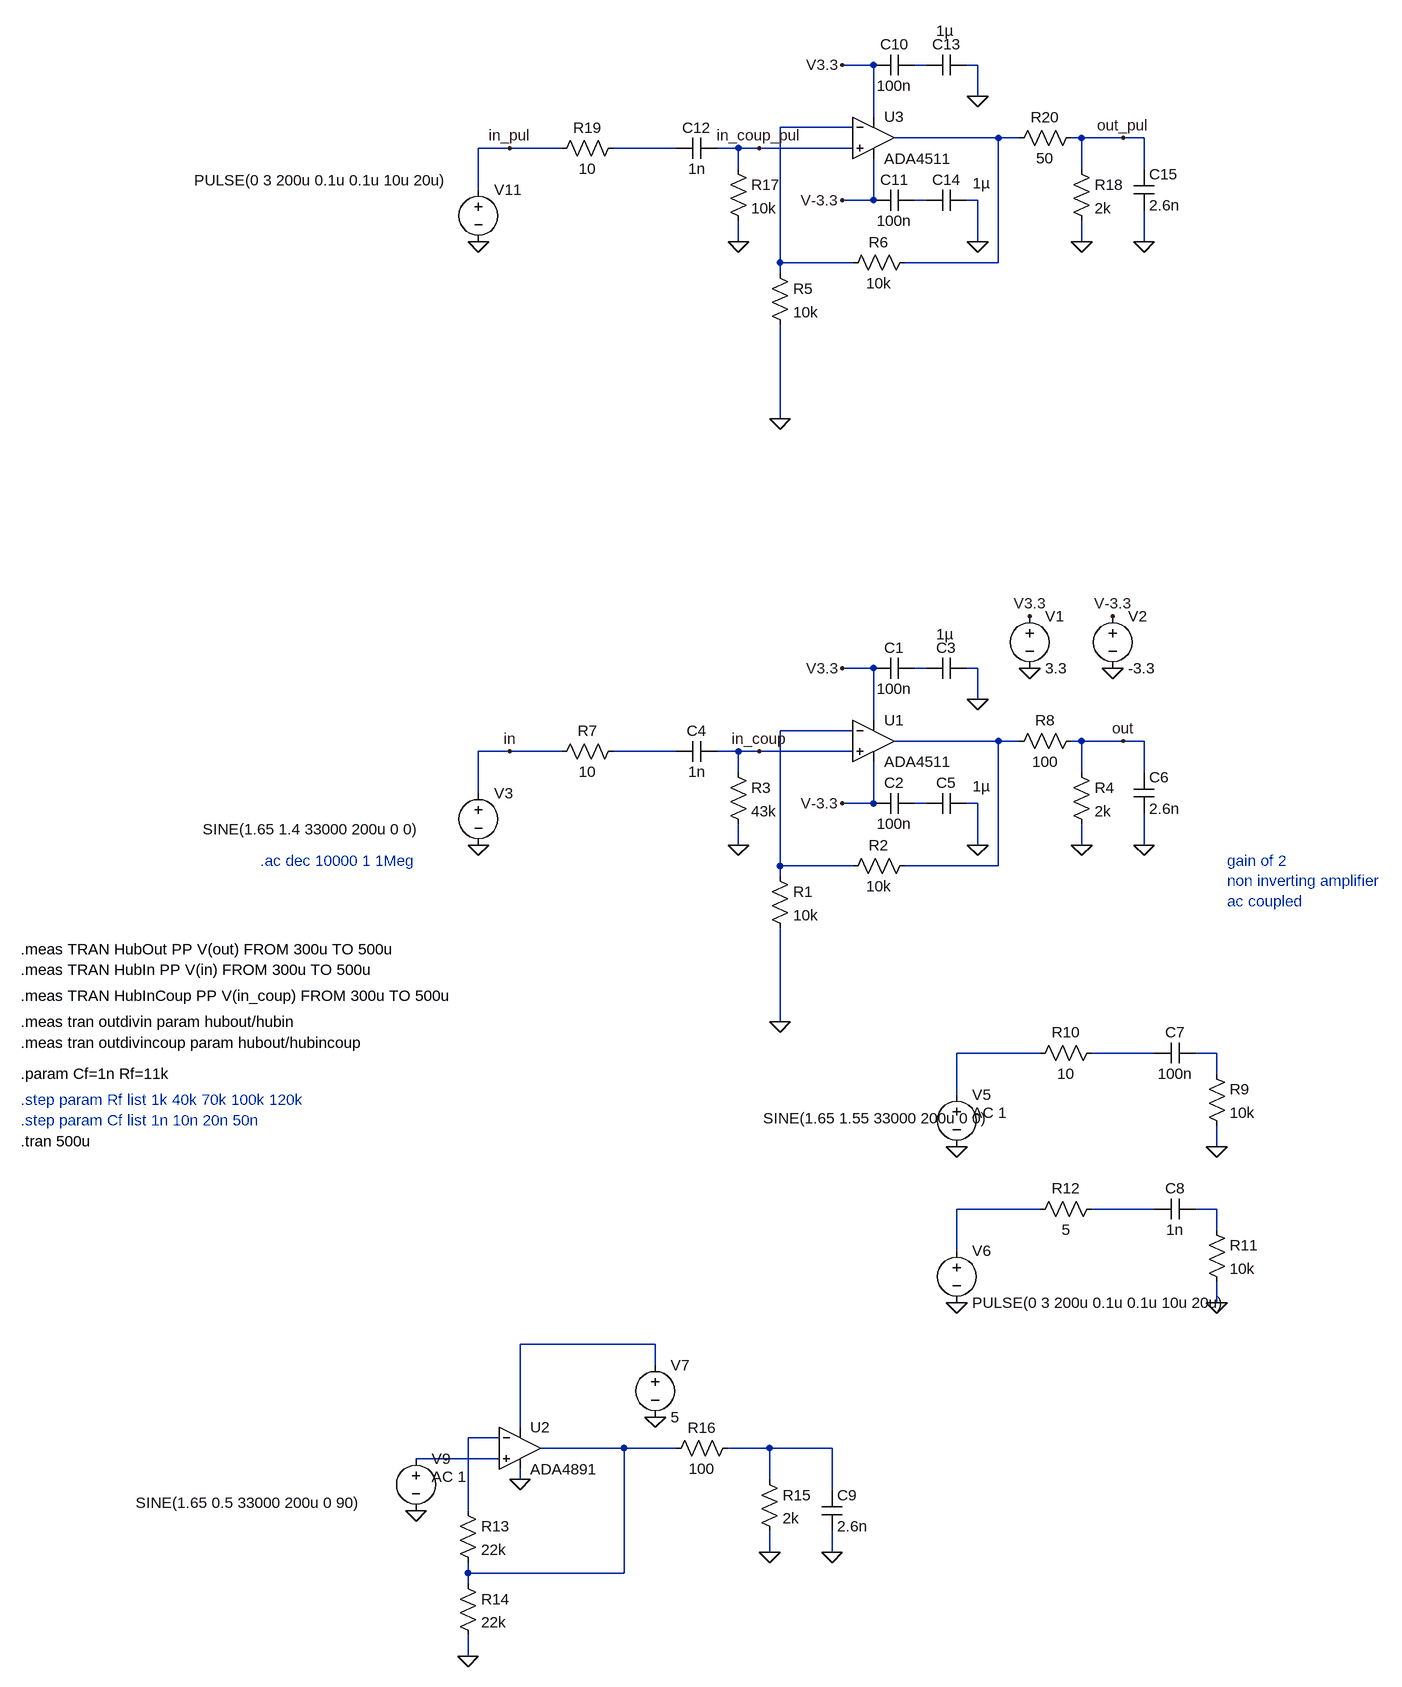
[diagram p0: schematic SpeakerSimulation.asc]
SpeakerSimulation.asc, the LTspice schematic file:
Version 4.1
SHEET 1 1052 1572
WIRE 240 -896 192 -896
WIRE 320 -896 304 -896
WIRE 400 -896 384 -896
WIRE 400 -848 400 -896
WIRE 240 -816 240 -896
WIRE 208 -800 96 -800
WIRE 432 -784 272 -784
WIRE 464 -784 432 -784
WIRE 560 -784 544 -784
WIRE 624 -784 560 -784
WIRE 656 -784 624 -784
WIRE -320 -768 -368 -768
WIRE -240 -768 -320 -768
WIRE -64 -768 -160 -768
WIRE 32 -768 0 -768
WIRE 64 -768 32 -768
WIRE 208 -768 64 -768
WIRE 32 -736 32 -768
WIRE 560 -736 560 -784
WIRE 656 -736 656 -784
WIRE -368 -704 -368 -768
WIRE 240 -688 240 -752
WIRE 240 -688 192 -688
WIRE 320 -688 304 -688
WIRE 400 -688 384 -688
WIRE 32 -624 32 -656
WIRE 400 -624 400 -688
WIRE 560 -624 560 -656
WIRE 656 -624 656 -672
WIRE 96 -592 96 -800
WIRE 208 -592 96 -592
WIRE 432 -592 432 -784
WIRE 432 -592 288 -592
WIRE 96 -576 96 -592
WIRE 96 -352 96 -496
WIRE 240 32 192 32
WIRE 320 32 304 32
WIRE 400 32 384 32
WIRE 400 80 400 32
WIRE 240 112 240 32
WIRE 208 128 96 128
WIRE 432 144 272 144
WIRE 464 144 432 144
WIRE 560 144 544 144
WIRE 624 144 560 144
WIRE 656 144 624 144
WIRE -320 160 -368 160
WIRE -240 160 -320 160
WIRE -64 160 -160 160
WIRE 32 160 0 160
WIRE 64 160 32 160
WIRE 208 160 64 160
WIRE 32 192 32 160
WIRE 560 192 560 144
WIRE 656 192 656 144
WIRE -368 224 -368 160
WIRE 240 240 240 176
WIRE 240 240 192 240
WIRE 320 240 304 240
WIRE 400 240 384 240
WIRE 32 304 32 272
WIRE 400 304 400 240
WIRE 560 304 560 272
WIRE 656 304 656 256
WIRE 96 336 96 128
WIRE 208 336 96 336
WIRE 432 336 432 144
WIRE 432 336 288 336
WIRE 96 352 96 336
WIRE 96 576 96 432
WIRE 496 624 368 624
WIRE 672 624 576 624
WIRE 768 624 736 624
WIRE 768 656 768 624
WIRE 368 688 368 624
WIRE 768 768 768 736
WIRE 496 864 368 864
WIRE 672 864 576 864
WIRE 768 864 736 864
WIRE 768 896 768 864
WIRE 368 928 368 864
WIRE 768 1008 768 976
WIRE -96 1072 -304 1072
WIRE -96 1104 -96 1072
WIRE -304 1200 -304 1072
WIRE -336 1216 -384 1216
WIRE -144 1232 -272 1232
WIRE -64 1232 -144 1232
WIRE 80 1232 16 1232
WIRE 176 1232 80 1232
WIRE -336 1248 -464 1248
WIRE -304 1280 -304 1264
WIRE 80 1280 80 1232
WIRE 176 1296 176 1232
WIRE -384 1328 -384 1216
WIRE 80 1392 80 1360
WIRE 176 1392 176 1360
WIRE -384 1424 -384 1408
WIRE -144 1424 -144 1232
WIRE -144 1424 -384 1424
WIRE -384 1440 -384 1424
WIRE -384 1552 -384 1520
FLAG 480 32 0
FLAG 608 32 0
FLAG 480 -48 V3.3
FLAG 608 -48 V-3.3
FLAG 400 80 0
FLAG 400 304 0
FLAG 192 240 V-3.3
FLAG 192 32 V3.3
FLAG 96 576 0
FLAG -368 304 0
FLAG 32 304 0
FLAG -320 160 in
FLAG 560 304 0
FLAG 656 304 0
FLAG 368 768 0
FLAG 768 768 0
FLAG 368 1008 0
FLAG 768 1008 0
FLAG -96 1184 0
FLAG -304 1280 0
FLAG -464 1328 0
FLAG -384 1552 0
FLAG 80 1392 0
FLAG 176 1392 0
FLAG 624 144 out
FLAG 64 160 in_coup
FLAG 400 -848 0
FLAG 400 -624 0
FLAG 192 -688 V-3.3
FLAG 192 -896 V3.3
FLAG 96 -352 0
FLAG -368 -624 0
FLAG 32 -624 0
FLAG -320 -768 in_pul
FLAG 560 -624 0
FLAG 656 -624 0
FLAG 624 -784 out_pul
FLAG 64 -768 in_coup_pul
SYMBOL OpAmps\\ADA4511 240 80 R0
SYMATTR InstName U1
SYMBOL voltage 480 -64 R0
WINDOW 123 0 0 Left 0
WINDOW 39 0 0 Left 0
SYMATTR InstName V1
SYMATTR Value 3.3
SYMBOL voltage 608 -64 R0
WINDOW 123 0 0 Left 0
WINDOW 39 0 0 Left 0
SYMATTR InstName V2
SYMATTR Value -3.3
SYMBOL cap 304 16 R90
WINDOW 0 0 32 VBottom 2
WINDOW 3 32 32 VTop 2
SYMATTR InstName C1
SYMATTR Value 100n
SYMBOL cap 304 224 R90
WINDOW 0 0 32 VBottom 2
WINDOW 3 32 32 VTop 2
SYMATTR InstName C2
SYMATTR Value 100n
SYMBOL res 80 336 R0
SYMATTR InstName R1
SYMATTR Value 10k
SYMBOL res 304 320 R90
WINDOW 0 0 56 VBottom 2
WINDOW 3 32 56 VTop 2
SYMATTR InstName R2
SYMATTR Value 10k
SYMBOL cap 0 144 R90
WINDOW 0 0 32 VBottom 2
WINDOW 3 32 32 VTop 2
SYMATTR InstName C4
SYMATTR Value 1n
SYMBOL res 16 176 R0
SYMATTR InstName R3
SYMATTR Value 43k
SYMBOL res 544 176 R0
SYMATTR InstName R4
SYMATTR Value 2k
SYMBOL cap 384 16 R90
WINDOW 0 0 32 VBottom 2
WINDOW 3 -52 34 VTop 2
SYMATTR InstName C3
SYMATTR Value 1µ
SYMBOL cap 384 224 R90
WINDOW 0 0 32 VBottom 2
WINDOW 3 -26 -22 VTop 2
SYMATTR InstName C5
SYMATTR Value 1µ
SYMBOL res -144 144 R90
WINDOW 0 0 56 VBottom 2
WINDOW 3 32 56 VTop 2
SYMATTR InstName R7
SYMATTR Value 10
SYMBOL res 560 128 R90
WINDOW 0 0 56 VBottom 2
WINDOW 3 32 56 VTop 2
SYMATTR InstName R8
SYMATTR Value 100
SYMBOL voltage 368 672 R0
WINDOW 3 -298 52 Left 2
WINDOW 123 24 44 Left 2
WINDOW 39 0 0 Left 0
SYMATTR Value SINE(1.65 1.55 33000 200u 0 0)
SYMATTR Value2 AC 1
SYMATTR InstName V5
SYMBOL cap 736 608 R90
WINDOW 0 0 32 VBottom 2
WINDOW 3 32 32 VTop 2
SYMATTR InstName C7
SYMATTR Value 100n
SYMBOL res 752 640 R0
SYMATTR InstName R9
SYMATTR Value 10k
SYMBOL res 592 608 R90
WINDOW 0 0 56 VBottom 2
WINDOW 3 32 56 VTop 2
SYMATTR InstName R10
SYMATTR Value 10
SYMBOL cap 736 848 R90
WINDOW 0 0 32 VBottom 2
WINDOW 3 32 32 VTop 2
SYMATTR InstName C8
SYMATTR Value 1n
SYMBOL res 752 880 R0
SYMATTR InstName R11
SYMATTR Value 10k
SYMBOL res 592 848 R90
WINDOW 0 0 56 VBottom 2
WINDOW 3 32 56 VTop 2
SYMATTR InstName R12
SYMATTR Value 5
SYMBOL voltage 368 912 R0
WINDOW 123 0 0 Left 0
WINDOW 39 0 0 Left 0
SYMATTR InstName V6
SYMATTR Value PULSE(0 3 200u 0.1u 0.1u 10u 20u)
SYMBOL OpAmps\\ADA4891 -304 1168 R0
SYMATTR InstName U2
SYMBOL voltage -96 1088 R0
WINDOW 123 0 0 Left 0
WINDOW 39 0 0 Left 0
SYMATTR InstName V7
SYMATTR Value 5
SYMBOL res -400 1312 R0
SYMATTR InstName R13
SYMATTR Value 22k
SYMBOL res -400 1424 R0
SYMATTR InstName R14
SYMATTR Value 22k
SYMBOL cap 640 192 R0
SYMATTR InstName C6
SYMATTR Value 2.6n
SYMBOL res 64 1264 R0
SYMATTR InstName R15
SYMATTR Value 2k
SYMBOL cap 160 1296 R0
SYMATTR InstName C9
SYMATTR Value 2.6n
SYMBOL voltage -464 1232 R0
WINDOW 3 -431 84 Left 2
WINDOW 123 24 44 Left 2
WINDOW 39 0 0 Left 0
SYMATTR Value SINE(1.65 0.5 33000 200u 0 90)
SYMATTR Value2 AC 1
SYMATTR InstName V9
SYMBOL voltage -368 208 R0
WINDOW 3 -424 72 Left 2
WINDOW 123 24 44 Left 2
WINDOW 39 0 0 Left 0
SYMATTR Value SINE(1.65 1.4 33000 200u 0 0)
SYMATTR InstName V3
SYMBOL res 32 1216 R90
WINDOW 0 0 56 VBottom 2
WINDOW 3 32 56 VTop 2
SYMATTR InstName R16
SYMATTR Value 100
SYMBOL OpAmps\\ADA4511 240 -848 R0
SYMATTR InstName U3
SYMBOL cap 304 -912 R90
WINDOW 0 0 32 VBottom 2
WINDOW 3 32 32 VTop 2
SYMATTR InstName C10
SYMATTR Value 100n
SYMBOL cap 304 -704 R90
WINDOW 0 0 32 VBottom 2
WINDOW 3 32 32 VTop 2
SYMATTR InstName C11
SYMATTR Value 100n
SYMBOL res 80 -592 R0
SYMATTR InstName R5
SYMATTR Value 10k
SYMBOL res 304 -608 R90
WINDOW 0 0 56 VBottom 2
WINDOW 3 32 56 VTop 2
SYMATTR InstName R6
SYMATTR Value 10k
SYMBOL cap 0 -784 R90
WINDOW 0 0 32 VBottom 2
WINDOW 3 32 32 VTop 2
SYMATTR InstName C12
SYMATTR Value 1n
SYMBOL res 16 -752 R0
SYMATTR InstName R17
SYMATTR Value 10k
SYMBOL res 544 -752 R0
SYMATTR InstName R18
SYMATTR Value 2k
SYMBOL cap 384 -912 R90
WINDOW 0 0 32 VBottom 2
WINDOW 3 -52 34 VTop 2
SYMATTR InstName C13
SYMATTR Value 1µ
SYMBOL cap 384 -704 R90
WINDOW 0 0 32 VBottom 2
WINDOW 3 -26 -22 VTop 2
SYMATTR InstName C14
SYMATTR Value 1µ
SYMBOL res -144 -784 R90
WINDOW 0 0 56 VBottom 2
WINDOW 3 32 56 VTop 2
SYMATTR InstName R19
SYMATTR Value 10
SYMBOL res 560 -800 R90
WINDOW 0 0 56 VBottom 2
WINDOW 3 32 56 VTop 2
SYMATTR InstName R20
SYMATTR Value 50
SYMBOL cap 640 -736 R0
SYMATTR InstName C15
SYMATTR Value 2.6n
SYMBOL voltage -368 -720 R0
WINDOW 3 -437 1 Left 2
WINDOW 123 0 0 Left 0
WINDOW 39 0 0 Left 0
SYMATTR Value PULSE(0 3 200u 0.1u 0.1u 10u 20u)
SYMATTR InstName V11
TEXT -704 328 Left 2 ;.ac dec 10000 1 1Meg
TEXT -1072 760 Left 2 !.tran 500u
TEXT 784 328 Left 2 ;gain of 2\nnon inverting amplifier\nac coupled
TEXT -1072 464 Left 2 !.meas TRAN HubOut PP V(out) FROM 300u TO 500u
TEXT -1072 496 Left 2 !.meas TRAN HubIn PP V(in) FROM 300u TO 500u
TEXT -1072 536 Left 2 !.meas TRAN HubInCoup PP V(in_coup) FROM 300u TO 500u
TEXT -1072 576 Left 2 !.meas tran outdivin param hubout/hubin
TEXT -1072 608 Left 2 !.meas tran outdivincoup param hubout/hubincoup
TEXT -1072 656 Left 2 !.param Cf=1n Rf=11k
TEXT -1072 696 Left 2 ;.step param Rf list 1k 40k 70k 100k 120k\n.step param Cf list 1n 10n 20n 50n

The netlist it stands for:
* SpeakerSimulation.asc
X§U1 in_coup N007 V3.3 V-3.3 N008 ADA4511  ; pins In+ In- V+ V- OUT
V1 V3.3 0 3.3
V2 V-3.3 0 -3.3
C1 N006 V3.3 100n
C2 N010 V-3.3 100n
R1 N007 0 10k
R2 N008 N007 10k
C4 in_coup N009 1n
R3 in_coup 0 43k
R4 out 0 2k
C3 0 N006 1µ
C5 0 N010 1µ
R7 N009 in 10
R8 out N008 100
V5 N011 0 SINE(1.65 1.55 33000 200u 0 0) AC 1
C7 N013 N012 100n
R9 N013 0 10k
R10 N012 N011 10
C8 N016 N015 1n
R11 N016 0 10k
R12 N015 N014 5
V6 N014 0 PULSE(0 3 200u 0.1u 0.1u 10u 20u)
X§U2 N021 N018 N017 0 N019 ADA4891-1  ; pins In+ In- V+ V- OUT
V7 N017 0 5
R13 N018 N019 22k
R14 N019 0 22k
C6 out 0 2.6n
R15 N020 0 2k
C9 N020 0 2.6n
V9 N021 0 SINE(1.65 0.5 33000 200u 0 90) AC 1
V3 in 0 SINE(1.65 1.4 33000 200u 0 0)
R16 N020 N019 100
X§U3 in_coup_pul N002 V3.3 V-3.3 N003 ADA4511  ; pins In+ In- V+ V- OUT
C10 N001 V3.3 100n
C11 N005 V-3.3 100n
R5 N002 0 10k
R6 N003 N002 10k
C12 in_coup_pul N004 1n
R17 in_coup_pul 0 10k
R18 out_pul 0 2k
C13 0 N001 1µ
C14 0 N005 1µ
R19 N004 in_pul 10
R20 out_pul N003 50
C15 out_pul 0 2.6n
V11 in_pul 0 PULSE(0 3 200u 0.1u 0.1u 10u 20u)
* .ac dec 10000 1 1Meg
.tran 500u
* gain of 2
* non inverting amplifier
* ac coupled
.meas TRAN HubOut PP V(out) FROM 300u TO 500u
.meas TRAN HubIn PP V(in) FROM 300u TO 500u
.meas TRAN HubInCoup PP V(in_coup) FROM 300u TO 500u
.meas tran outdivin param hubout/hubin
.meas tran outdivincoup param hubout/hubincoup
.param Cf=1n Rf=11k
* .step param Rf list 1k 40k 70k 100k 120k
* .step param Cf list 1n 10n 20n 50n
.lib ADA4891-1.lib
.backanno
.end